# Altium schematic sheet filter.SchDoc
size 381 x 241 mm; SheetNumber: 11; SheetTotal: 13
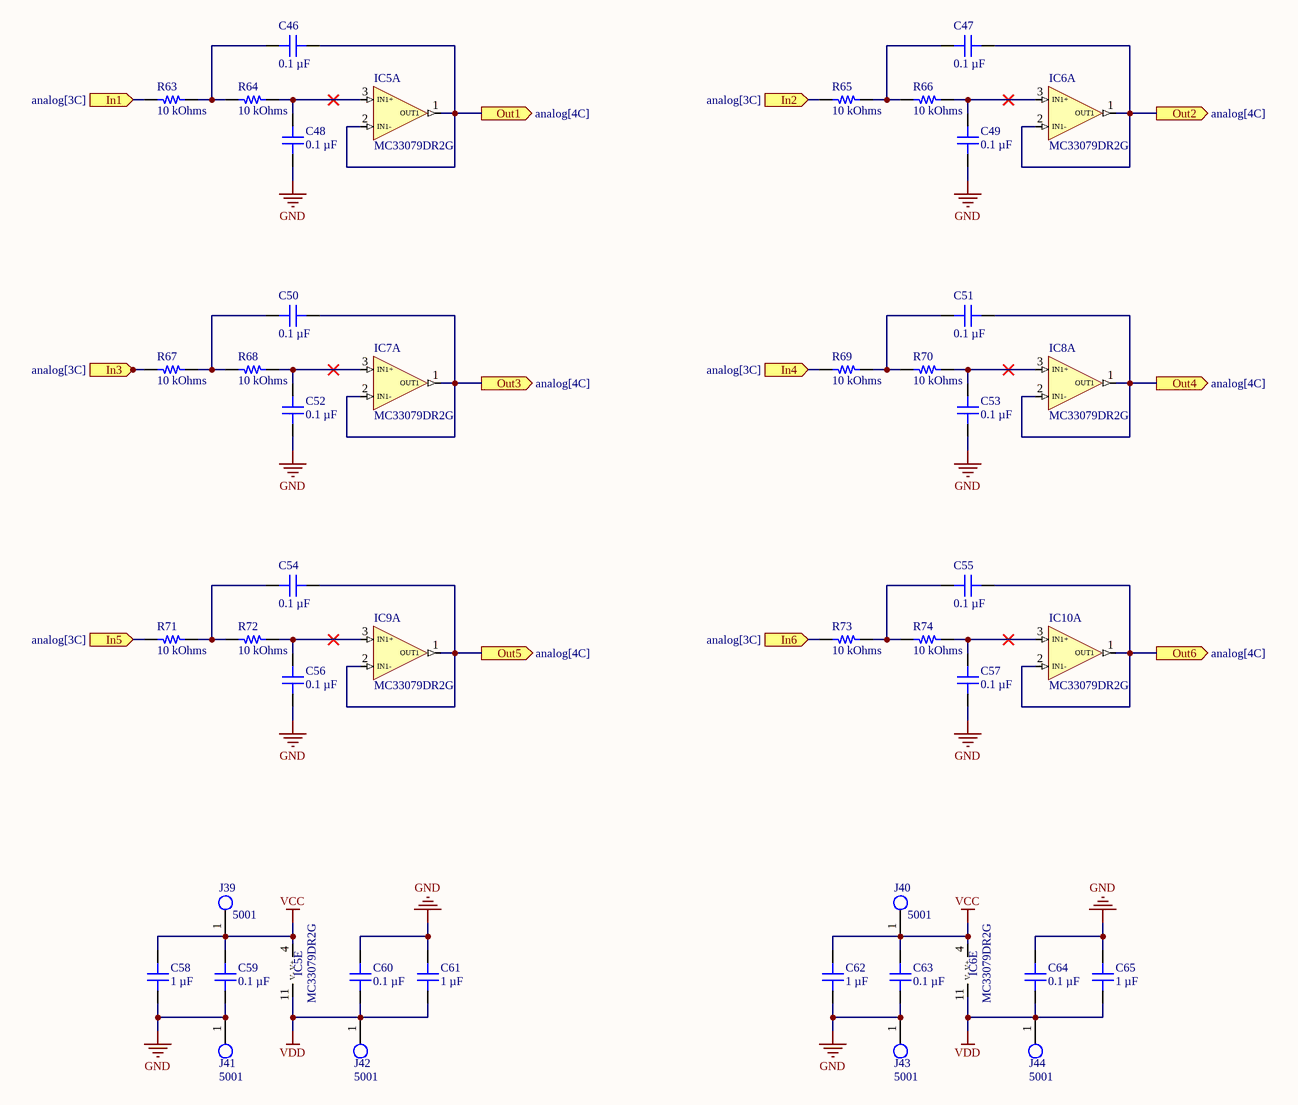
[diagram p0: filter.SchDoc]

## Parts
C46  0.1 µF  [CAP 1206_3216 - 0.8MM]
C47  0.1 µF  [CAP 1206_3216 - 0.8MM]
C48  0.1 µF  [CAP 1206_3216 - 0.8MM]
C49  0.1 µF  [CAP 1206_3216 - 0.8MM]
C50  0.1 µF  [CAP 1206_3216 - 0.8MM]
C51  0.1 µF  [CAP 1206_3216 - 0.8MM]
C52  0.1 µF  [CAP 1206_3216 - 0.8MM]
C53  0.1 µF  [CAP 1206_3216 - 0.8MM]
C54  0.1 µF  [CAP 1206_3216 - 0.8MM]
C55  0.1 µF  [CAP 1206_3216 - 0.8MM]
C56  0.1 µF  [CAP 1206_3216 - 0.8MM]
C57  0.1 µF  [CAP 1206_3216 - 0.8MM]
C58  1 µF  [CAP 1206_3216 - 0.8MM]
C59  0.1 µF  [CAP 1206_3216 - 0.8MM]
C60  0.1 µF  [CAP 1206_3216 - 0.8MM]
C61  1 µF  [CAP 1206_3216 - 0.8MM]
C62  1 µF  [CAP 1206_3216 - 0.8MM]
C63  0.1 µF  [CAP 1206_3216 - 0.8MM]
C64  0.1 µF  [CAP 1206_3216 - 0.8MM]
C65  1 µF  [CAP 1206_3216 - 0.8MM]
IC5  MC33079DR2G  [SOIC127P600X175-14N]  (parts A,E of 5)
IC6  MC33079DR2G  [SOIC127P600X175-14N]  (parts A,E of 5)
IC7  MC33079DR2G  [SOIC127P600X175-14N]  (part A of 5)
IC8  MC33079DR2G  [SOIC127P600X175-14N]  (part A of 5)
IC9  MC33079DR2G  [SOIC127P600X175-14N]  (part A of 5)
IC10  MC33079DR2G  [SOIC127P600X175-14N]  (part A of 5)
J39  5001  [FP-5001-MFG]
J40  5001  [FP-5001-MFG]
J41  5001  [FP-5001-MFG]
J42  5001  [FP-5001-MFG]
J43  5001  [FP-5001-MFG]
J44  5001  [FP-5001-MFG]
R63  10 kOhms  [YAGEO RES 1206_3216]
R64  10 kOhms  [YAGEO RES 1206_3216]
R65  10 kOhms  [YAGEO RES 1206_3216]
R66  10 kOhms  [YAGEO RES 1206_3216]
R67  10 kOhms  [YAGEO RES 1206_3216]
R68  10 kOhms  [YAGEO RES 1206_3216]
R69  10 kOhms  [YAGEO RES 1206_3216]
R70  10 kOhms  [YAGEO RES 1206_3216]
R71  10 kOhms  [YAGEO RES 1206_3216]
R72  10 kOhms  [YAGEO RES 1206_3216]
R73  10 kOhms  [YAGEO RES 1206_3216]
R74  10 kOhms  [YAGEO RES 1206_3216]

## Ports
In1 (in, see analog[3C]), In2 (in, see analog[3C]), In3 (in, see analog[3C]), In4 (in, see analog[3C]), In5 (in, see analog[3C]), In6 (in, see analog[3C]), Out1 (out, see analog[4C]), Out2 (out, see analog[4C]), Out3 (out, see analog[4C]), Out4 (out, see analog[4C]), Out5 (out, see analog[4C]), Out6 (out, see analog[4C])

## Nets
GND: C48.2 C49.2 C52.2 C53.2 C56.2 C57.2 C58.1 C59.1 C60.2 C61.2 C62.1 C63.1 C64.2 C65.2 J41.1 J43.1
VCC: C58.2 C59.2 C62.2 C63.2 IC5.4(V+) IC6.4(V+) J39.1 J40.1
VDD: C60.1 C61.1 C64.1 C65.1 IC5.11(V-) IC6.11(V-) J42.1 J44.1
In1: R63.2 ; port In1
In2: R65.2 ; port In2
In3: R67.2 ; port In3
In4: R69.2 ; port In4
In5: R71.2 ; port In5
In6: R73.2 ; port In6
Out1: C46.1 IC5.1(OUT1) IC5.2(IN1-) ; port Out1
Out2: C47.1 IC6.1(OUT1) IC6.2(IN1-) ; port Out2
Out3: C50.1 IC7.1(OUT1) IC7.2(IN1-) ; port Out3
Out4: C51.1 IC8.1(OUT1) IC8.2(IN1-) ; port Out4
Out5: C54.1 IC9.1(OUT1) IC9.2(IN1-) ; port Out5
Out6: C55.1 IC10.1(OUT1) IC10.2(IN1-) ; port Out6
NetC46_2: C46.2 R63.1 R64.2
NetC47_2: C47.2 R65.1 R66.2
NetC48_1: C48.1 IC5.3(IN1+) R64.1
NetC49_1: C49.1 IC6.3(IN1+) R66.1
NetC50_2: C50.2 R67.1 R68.2
NetC51_2: C51.2 R69.1 R70.2
NetC52_1: C52.1 IC7.3(IN1+) R68.1
NetC53_1: C53.1 IC8.3(IN1+) R70.1
NetC54_2: C54.2 R71.1 R72.2
NetC55_2: C55.2 R73.1 R74.2
NetC56_1: C56.1 IC9.3(IN1+) R72.1
NetC57_1: C57.1 IC10.3(IN1+) R74.1

## Library data of the parts
C46-C57 C59 C60 C63 C64 = 885012208087: CAP CER 0.1UF 50V X7R 1206; manufacturer: Würth Elektronik; Tolerance: ±10%; Part Number: 885012208087; Capacitance: 0.1 µF; Applications: General Purpose; componentlink1description: Datasheet; componentlink1url: https://katalog.we-online.de/pbs/datasheet/885012208087.pdf; componentlink2description: DigiKey Link; componentlink2url: https://www.digikey.com/en/products/detail/würth-elektronik/885012208087/5453982; Device Package: 1206 (3216 Metric); lastupdated: 6/4/2024 19:10:27; Lifecycle Status: Active; Minimum Order: 1; Mounting Type: Surface Mount, MLCC; Operating Temperature: -55°C ~ 125°C; Package / Case: 1206 (3216 Metric); packaging: TapeAndReel; partid: 20879; Part Status: Active; price: 0.06; series: WCAP-CSGP; Size / Dimension: 0.126" L x 0.063" W (3.20mm x 1.60mm); Supplier 1: DigiKey; Supplier Part Number 1: 732-8127-1-ND; Temperature Coefficient: X7R; Thickness (Max): 0.035" (0.90mm); value: 0.1 µF; Voltage - Rated: 50V
C58 C61 C62 C65 = 885012208093: CAP CER 1UF 50V X7R 1206; manufacturer: Würth Elektronik; Tolerance: ±10%; Part Number: 885012208093; Capacitance: 1 µF; Applications: General Purpose; componentlink1description: Datasheet; componentlink1url: https://katalog.we-online.de/pbs/datasheet/885012208093.pdf; componentlink2description: DigiKey Link; componentlink2url: https://www.digikey.com/en/products/detail/würth-elektronik/885012208093/5453432; Device Package: 1206 (3216 Metric); lastupdated: 6/4/2024 19:10:33; Lifecycle Status: Active; Minimum Order: 1; Mounting Type: Surface Mount, MLCC; Operating Temperature: -55°C ~ 125°C; Package / Case: 1206 (3216 Metric); packaging: TapeAndReel; partid: 39665; Part Status: Active; price: 0.10; series: WCAP-CSGP; Size / Dimension: 0.126" L x 0.063" W (3.20mm x 1.60mm); Supplier 1: DigiKey; Supplier Part Number 1: 732-7577-1-ND; Temperature Coefficient: X7R; Thickness (Max): 0.075" (1.90mm); value: 1 µF; Voltage - Rated: 50V
IC5-IC10 = MC33079DR2G: Integrated Circuit; Manufacturer_Name: onsemi; Datasheet Link: https://www.onsemi.com/pub/Collateral/MC33078-D.PDF; Height: 1.75mm; Manufacturer_Part_Number: MC33079DR2G; Mouser Part Number: 863-MC33079DR2G; Mouser Price/Stock: https://www.mouser.co.uk/ProductDetail/onsemi/MC33079DR2G?qs=g2rIOKKlpoa9LEjz5JLClg%3D%3D; Arrow Part Number: MC33079DR2G; Arrow Price/Stock: https://www.arrow.com/en/products/mc33079dr2g/on-semiconductor?region=asia
J39-J44 = CMP-2000-05181-2: PC TEST POINT MINIATURE BLACK; Body Material: Bronze; Plating: Silver; Inside Diameter: 1.27mm; Hole Diameter: 1.6mm; Number of Ports: 1; Outside Diameter: 2.54mm; Insulation: Insulated; Insulation Material: Nylon; Mount: Through Hole; RoHS Compliant: Yes; Series: THM; Height: 0.3inch; Termination: Through Hole; Material: Nylon; Packaging: Bulk; Contact Material: Bronze; REACH SVHC: No SVHC; Contact Plating: Silver; Orientation: Straight; Lead Free: Lead Free; Package Quantity: 100; Length: 7.62mm; Flammability Rating: UL94 V-0; Number of Contacts: 1; Diameter: 2.54mm; Housing Color: Black; Color: Black
R63-R74 = RT1206FRE0710KL: RES SMD 10K OHM 1% 1/4W 1206; Manufacturer: Yageo; Power (Watts): 0.25W, 1/4W; Temperature Coefficient: ±50ppm/°C; Part Number: RT1206FRE0710KL; ComponentLink1Description: Datasheet; ComponentLink1URL: https://www.yageo.com/upload/media/product/productsearch/datasheet/rchip/PYu-RT_1-to-0.01_RoHS_L_11.pdf; ComponentLink2Description: DigiKey Link; ComponentLink2URL: https://www.digikey.com/en/products/detail/yageo/RT1206FRE0710KL/1082868; Composition: Thin Film; Device Package: 1206 (3216 Metric); Height - Seated (Max): 0.026" (0.65mm); LastUpdated: 7/25/2024 09:21:28; Lifecycle Status: Active; Minimum Order: 1; Number of Terminations: 2; Operating Temperature: -55°C ~ 155°C; Package / Case: 1206 (3216 Metric); Packaging: TapeAndReel; PartId: 38903; Part Status: Active; Price: 0.01; Resistance: 10 kOhms; Series: RT; Size / Dimension: 0.122" L x 0.063" W (3.10mm x 1.60mm); Supplier 1: DigiKey; Supplier Part Number 1: YAG1242CT-ND; Supplier Device Package: 1206; Tolerance: ±1%; Value: 10 kOhms